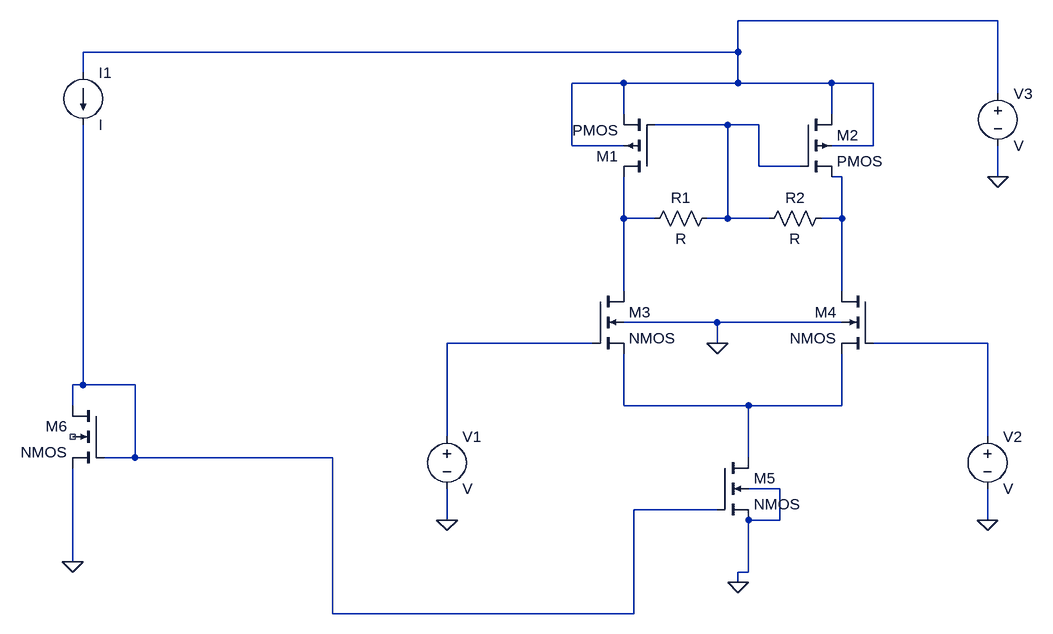
[diagram p0: schematic 2b_diffamp_current_mirror_feedback.asc]
2b_diffamp_current_mirror_feedback.asc, the LTspice schematic file:
Version 4
SHEET 1 880 680
WIRE 672 -336 272 -336
WIRE 272 -288 272 -336
WIRE 272 -288 -736 -288
WIRE -736 -256 -736 -288
WIRE 96 -240 16 -240
WIRE 272 -240 272 -288
WIRE 272 -240 96 -240
WIRE 416 -240 272 -240
WIRE 480 -240 416 -240
WIRE 672 -224 672 -336
WIRE 96 -192 96 -240
WIRE 416 -192 416 -240
WIRE 256 -176 144 -176
WIRE 304 -176 256 -176
WIRE 16 -144 16 -240
WIRE 96 -144 16 -144
WIRE 480 -144 480 -240
WIRE 480 -144 416 -144
WIRE 304 -112 304 -176
WIRE 368 -112 304 -112
WIRE 432 -96 416 -96
WIRE 672 -96 672 -144
WIRE 96 -32 96 -96
WIRE 144 -32 96 -32
WIRE 256 -32 256 -176
WIRE 256 -32 224 -32
WIRE 320 -32 256 -32
WIRE 432 -32 432 -96
WIRE 432 -32 400 -32
WIRE 96 80 96 -32
WIRE 432 80 432 -32
WIRE 240 128 96 128
WIRE 432 128 240 128
WIRE 48 160 -176 160
WIRE 240 160 240 128
WIRE 656 160 480 160
WIRE -736 224 -736 -176
WIRE -736 224 -752 224
WIRE -656 224 -736 224
WIRE -752 256 -752 224
WIRE 96 256 96 176
WIRE 288 256 96 256
WIRE 432 256 432 176
WIRE 432 256 288 256
WIRE -176 304 -176 160
WIRE 656 304 656 160
WIRE -656 336 -656 224
WIRE -656 336 -704 336
WIRE -352 336 -656 336
WIRE 288 336 288 256
WIRE 336 384 288 384
WIRE 240 416 112 416
WIRE -176 432 -176 384
WIRE 336 432 336 384
WIRE 336 432 288 432
WIRE 656 432 656 384
WIRE -752 496 -752 352
WIRE 288 512 288 432
WIRE 288 512 272 512
WIRE 272 528 272 512
WIRE -352 576 -352 336
WIRE 112 576 112 416
WIRE 112 576 -352 576
FLAG 240 160 0
FLAG -176 432 0
FLAG 656 432 0
FLAG 672 -96 0
FLAG 272 528 0
FLAG -752 496 0
SYMBOL pmos4 144 -96 R180
SYMATTR InstName M1
SYMBOL pmos4 368 -192 R0
SYMATTR InstName M2
SYMBOL nmos4 48 80 R0
SYMATTR InstName M3
SYMBOL nmos4 480 80 M0
SYMATTR InstName M4
SYMBOL nmos4 240 336 R0
SYMATTR InstName M5
SYMBOL res 240 -48 R90
WINDOW 0 0 56 VBottom 2
WINDOW 3 32 56 VTop 2
SYMATTR InstName R1
SYMBOL res 416 -48 R90
WINDOW 0 0 56 VBottom 2
WINDOW 3 32 56 VTop 2
SYMATTR InstName R2
SYMBOL voltage -176 288 R0
SYMATTR InstName V1
SYMBOL voltage 656 288 R0
SYMATTR InstName V2
SYMBOL voltage 672 -240 R0
SYMATTR InstName V3
SYMBOL current -736 -256 R0
SYMATTR InstName I1
SYMBOL nmos4 -704 256 M0
SYMATTR InstName M6

The netlist it stands for:
* 2b_diffamp_current_mirror_feedback.asc
M1 N004 N002 N001 N001 PMOS
M2 N001 N002 N003 N001 PMOS
M3 N004 N005 N008 0 NMOS
M4 N003 N006 N008 0 NMOS
M5 N008 N007 0 0 NMOS
R1 N002 N004 R
R2 N003 N002 R
V1 N005 0 V
V2 N006 0 V
V3 N001 0 V
I1 N001 N007 I
M6 N007 N007 0 NC_01 NMOS
.model NMOS NMOS
.model PMOS PMOS
.lib standard.mos
.backanno
.end